# Altium schematic sheet 09 NOR NANDFlash_TF Car.SchDoc
size 420 x 297 mm; Organization: Altium Limited; Address1: L3, 12a Rodborough Rd; Address2: Frenchs Forest; Address3: NSW; Address4: Australia 2086
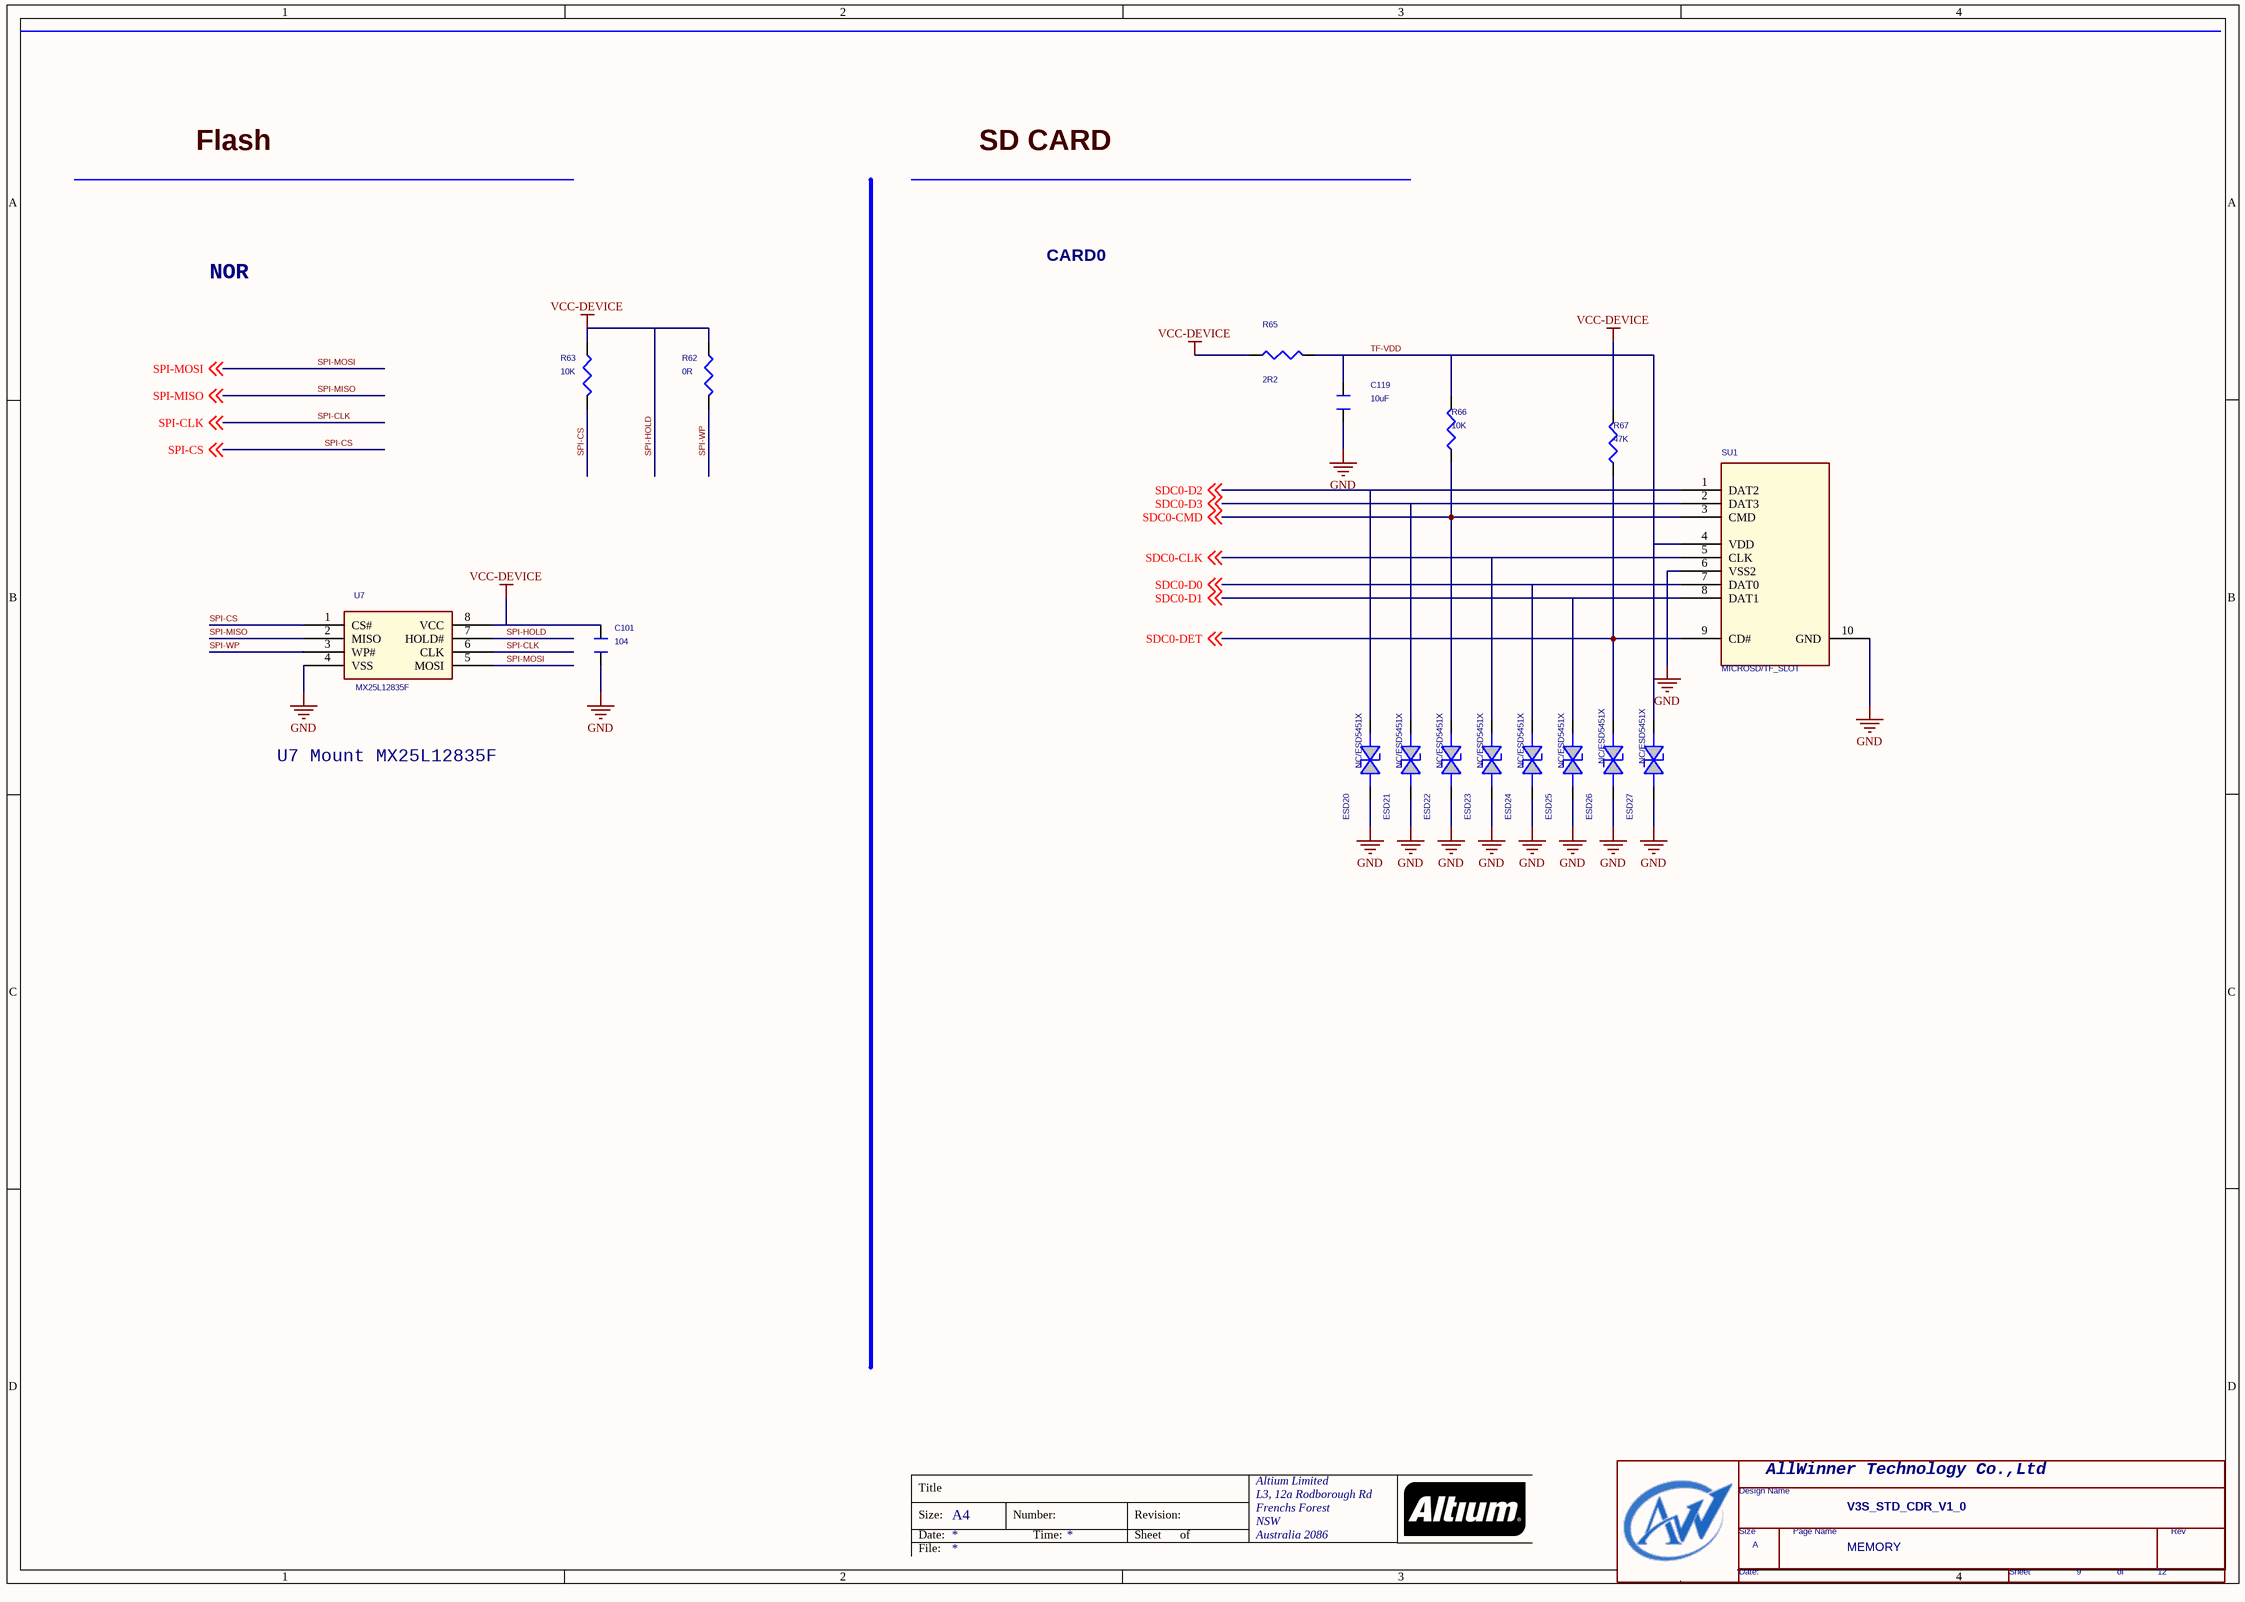
[diagram p0: 09 NOR NANDFlash_TF Car.SchDoc]

## Parts
*  Page Count: 12  Page Number: 9  Page Size: A  Title: V3S_STD_CDR_V1_0  Doc: MEMORY  (hidden comment: TitleBlock0-AW)  (graphical)
C101  104  [C0402]
C119  10uF  [C0603]
ESD20  NC/ESD5451X  [ESD0402]
ESD21  NC/ESD5451X  [ESD0402]
ESD22  NC/ESD5451X  [ESD0402]
ESD23  NC/ESD5451X  [ESD0402]
ESD24  NC/ESD5451X  [ESD0402]
ESD25  NC/ESD5451X  [ESD0402]
ESD26  NC/ESD5451X  [ESD0402]
ESD27  NC/ESD5451X  [ESD0402]
R62  0R  [R0402]
R63  10K  [R0402]
R65  2R2  [R0402]
R66  10K  [R0402]
R67  47K  [R0402]
SU1  MICROSD/TF_SLOT  [MICRO-SD-TF]
U7  MX25L12835F  [SOIC-8]

## Nets
GND: C101.1 C119.1 ESD20.2(CATHODE) ESD21.2(CATHODE) ESD22.2(CATHODE) ESD23.2(CATHODE) ESD24.2(CATHODE) ESD25.2(CATHODE) ESD26.2(CATHODE) ESD27.2(CATHODE) SU1.6(VSS2) SU1.10(GND) U7.4(VSS)
SPI-HOLD: C101.2 R62.1 R63.1 R65.1 R67.2 U7.7(HOLD#) U7.8(VCC)  [also labelled VCC-DEVICE]
SDC0-CLK: ESD23.1(ANODE) SU1.5(CLK) ; off-sheet SDC0-CLK
SDC0-CMD: ESD22.1(ANODE) R66.1 SU1.3(CMD) ; off-sheet SDC0-CMD
SDC0-D0: ESD24.1(ANODE) SU1.7(DAT0) ; off-sheet SDC0-D0
SDC0-D1: ESD25.1(ANODE) SU1.8(DAT1) ; off-sheet SDC0-D1
SDC0-D2: ESD20.1(ANODE) SU1.1(DAT2) ; off-sheet SDC0-D2
SDC0-D3: ESD21.1(ANODE) SU1.2(DAT3) ; off-sheet SDC0-D3
SDC0-DET: ESD26.1(ANODE) R67.1 SU1.9(CD#) ; off-sheet SDC0-DET
SPI-CLK: U7.6(CLK) ; off-sheet SPI-CLK
SPI-CS: R63.2 U7.1(CS#) ; off-sheet SPI-CS
SPI-MISO: U7.2(MISO) ; off-sheet SPI-MISO
SPI-MOSI: U7.5(MOSI) ; off-sheet SPI-MOSI
SPI-WP: R62.2 U7.3(WP#)
TF-VDD: C119.2 ESD27.1(ANODE) R65.2 R66.2 SU1.4(VDD)

## Notes on the sheet
- Flash
- SD CARD
- CARD0
- NOR
- U7 Mount MX25L12835F
- Title
- Size:
- Date:
- A4
- Number:
- Time:
- Revision:
- Sheet
- of
- File:
- (in symbol TitleBlock0-AW) AllWinner Technology Co.,Ltd; Design Name; Size; Page Name; Rev; Date:; Sheet; of

## Library data of the parts
* = TitleBlock0-AW: RevCode: 0.1; Page Create Date: March  8, 1995
C101 = CAPACITOR_Dup1: PAGE: 7
C119 = CAPACITOR_Dup1
ESD20-ESD27 = 1_1.5KE100A: 1ST PART DESCRIPTION: WILL ESD9B5V Bidirection ESD Protection; Page: 11
R62 R63 = RESISTOR_Dup1: PAGE: 7
R65 = RESISTOR_Dup1: PAGE: 3
R66 R67 = R_Dup3
SU1 = SDMMC SLOT_11
U7 = SPI-NOR-SO8: PAGE: 7